# Altium schematic sheet SODIMM.SchDoc: SODIMM Harness
size A4; Engineer: Jarrett Rainier; DocumentNumber: 2; Revision: 1; SheetNumber: 1; SheetTotal: 1; ProjectTitle: Raspberry Pi Compute Module
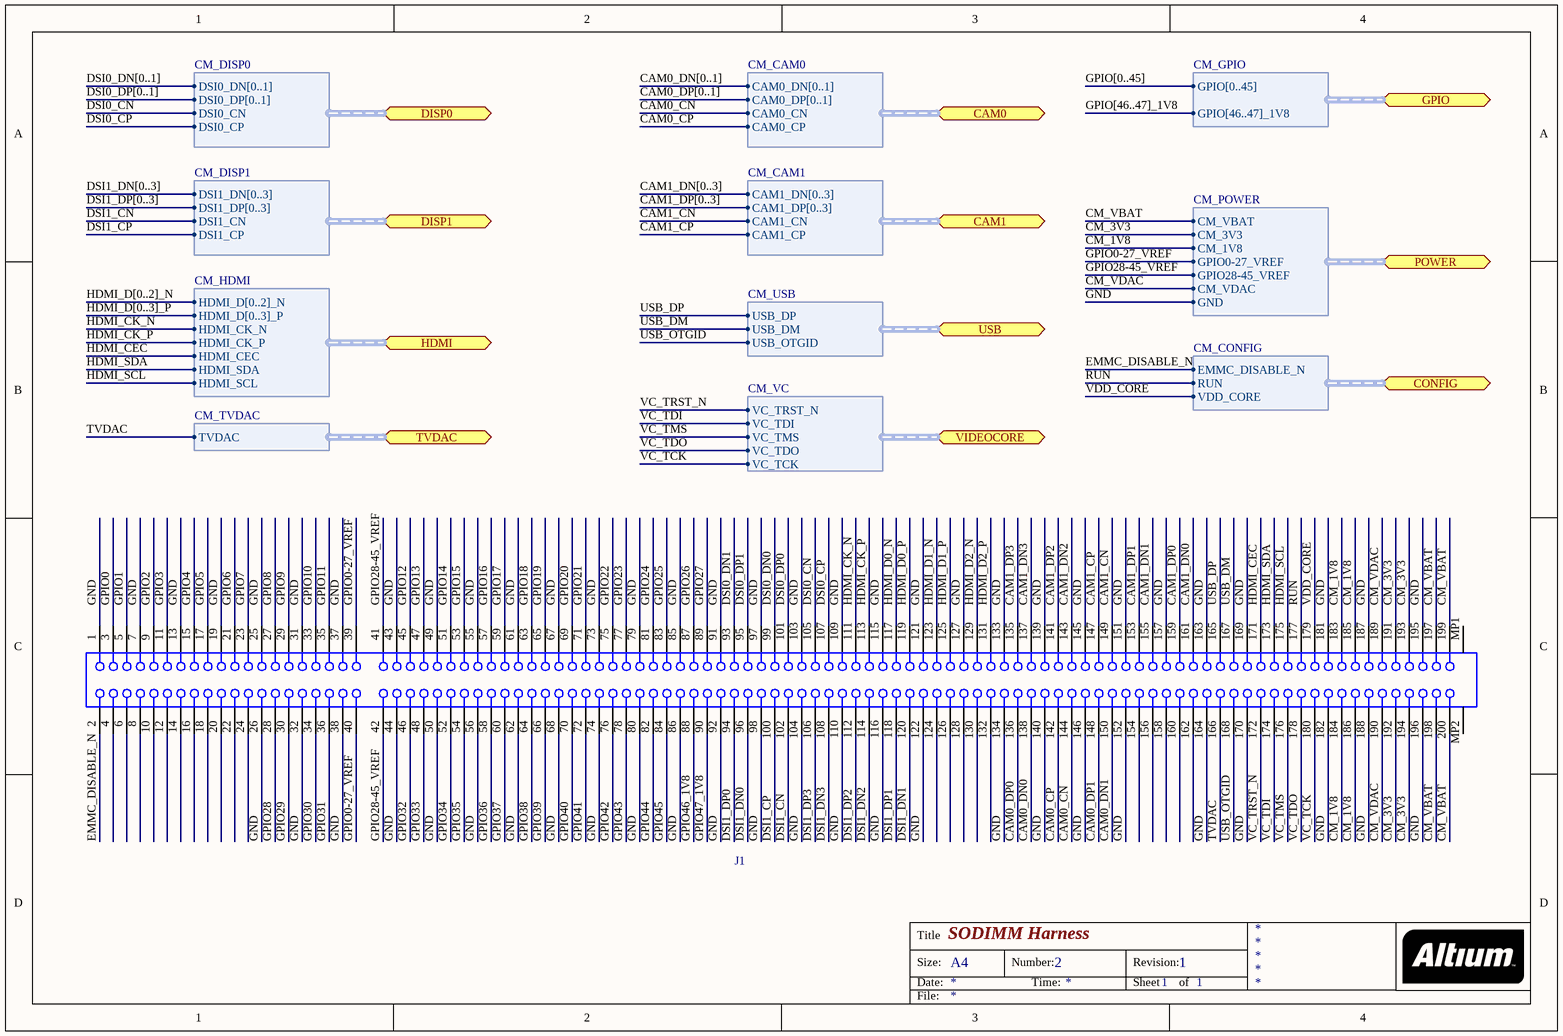
[diagram p0: SODIMM.SchDoc]

## Parts
J1  (no value)  [BTB-SM0-6-2V200]

## Ports
CAM0 (harness CM_CAM0), CAM1 (harness CM_CAM1), CONFIG (harness CM_CONFIG), DISP0 (harness CM_DISP0), DISP1 (harness CM_DISP1), GPIO (harness CM_GPIO), HDMI (harness CM_HDMI), POWER (harness CM_POWER), TVDAC (harness CM_TVDAC), USB (harness CM_USB), VIDEOCORE (harness CM_VC)

## Harnesses
CM_GPIO: GPIO[0..45], GPIO[46..47]_1V8
CM_CONFIG: EMMC_DISABLE_N, RUN, VDD_CORE
CM_CAM0: CAM0_DN[0..1], CAM0_DP[0..1], CAM0_CN, CAM0_CP
CM_POWER: CM_VBAT, CM_3V3, CM_1V8, GPIO0-27_VREF, GPIO28-45_VREF, CM_VDAC, GND
CM_CAM1: CAM1_DN[0..3], CAM1_DP[0..3], CAM1_CN, CAM1_CP
CM_DISP0: DSI0_DN[0..1], DSI0_DP[0..1], DSI0_CN, DSI0_CP
CM_DISP1: DSI1_DN[0..3], DSI1_DP[0..3], DSI1_CN, DSI1_CP
CM_HDMI: HDMI_D[0..2]_N, HDMI_D[0..3]_P, HDMI_CK_N, HDMI_CK_P, HDMI_CEC, HDMI_SDA, HDMI_SCL
CM_USB: USB_DP, USB_DM, USB_OTGID
CM_VC: VC_TRST_N, VC_TDI, VC_TMS, VC_TDO, VC_TCK
CM_TVDAC: TVDAC

## Nets
CAM0_CN: J1.144 ; port CAM0.CAM0_CN
CAM0_CP: J1.142 ; port CAM0.CAM0_CP
CAM0_DN0: J1.138
CAM0_DN1: J1.150
CAM0_DP0: J1.136
CAM0_DP1: J1.148
CAM1_CN: J1.149 ; port CAM1.CAM1_CN
CAM1_CP: J1.147 ; port CAM1.CAM1_CP
CAM1_DN0: J1.161
CAM1_DN1: J1.155
CAM1_DN2: J1.143
CAM1_DN3: J1.137
CAM1_DP0: J1.159
CAM1_DP1: J1.153
CAM1_DP2: J1.141
CAM1_DP3: J1.135
CM_1V8: J1.183 J1.184 J1.185 J1.186 ; port POWER.CM_1V8
CM_3V3: J1.191 J1.192 J1.193 J1.194 ; port POWER.CM_3V3
CM_VBAT: J1.197 J1.198 J1.199 J1.200 ; port POWER.CM_VBAT
CM_VDAC: J1.189 J1.190 ; port POWER.CM_VDAC
DSI0_CN: J1.105 ; port DISP0.DSI0_CN
DSI0_CP: J1.107 ; port DISP0.DSI0_CP
DSI0_DN0: J1.99
DSI0_DN1: J1.93
DSI0_DP0: J1.101
DSI0_DP1: J1.95
DSI1_CN: J1.102 ; port DISP1.DSI1_CN
DSI1_CP: J1.100 ; port DISP1.DSI1_CP
DSI1_DN0: J1.96
DSI1_DN1: J1.120
DSI1_DN2: J1.114
DSI1_DN3: J1.108
DSI1_DP0: J1.94
DSI1_DP1: J1.118
DSI1_DP2: J1.112
DSI1_DP3: J1.106
EMMC_DISABLE_N: J1.2 ; port CONFIG.EMMC_DISABLE_N
GND: J1.1 J1.7 J1.13 J1.19 J1.25 J1.26 J1.31 J1.32 J1.37 J1.38 J1.43 J1.44 J1.49 J1.50 J1.55 J1.56 J1.61 J1.62 J1.67 J1.68 J1.73 J1.74 J1.79 J1.80 J1.85 J1.86 J1.91 J1.92 J1.97 J1.98 J1.103 J1.104 J1.109 J1.110 J1.115 J1.116 J1.121 J1.122 J1.127 J1.133 J1.134 J1.139 J1.140 J1.145 J1.146 J1.151 J1.152 J1.157 J1.163 J1.164 J1.169 J1.170 J1.181 J1.182 J1.187 J1.188 J1.195 J1.196 ; port POWER.GND
GPIO0: J1.3
GPIO0-27_VREF: J1.39 J1.40 ; port POWER.GPIO0-27_VREF
GPIO1: J1.5
GPIO2: J1.9
GPIO3: J1.11
GPIO4: J1.15
GPIO5: J1.17
GPIO6: J1.21
GPIO7: J1.23
GPIO8: J1.27
GPIO9: J1.29
GPIO10: J1.33
GPIO11: J1.35
GPIO12: J1.45
GPIO13: J1.47
GPIO14: J1.51
GPIO15: J1.53
GPIO16: J1.57
GPIO17: J1.59
GPIO18: J1.63
GPIO19: J1.65
GPIO20: J1.69
GPIO21: J1.71
GPIO22: J1.75
GPIO23: J1.77
GPIO24: J1.81
GPIO25: J1.83
GPIO26: J1.87
GPIO27: J1.89
GPIO28: J1.28
GPIO28-45_VREF: J1.41 J1.42 ; port POWER.GPIO28-45_VREF
GPIO29: J1.30
GPIO30: J1.34
GPIO31: J1.36
GPIO32: J1.46
GPIO33: J1.48
GPIO34: J1.52
GPIO35: J1.54
GPIO36: J1.58
GPIO37: J1.60
GPIO38: J1.64
GPIO39: J1.66
GPIO40: J1.70
GPIO41: J1.72
GPIO42: J1.76
GPIO43: J1.78
GPIO44: J1.82
GPIO45: J1.84
GPIO46_1V8: J1.88
GPIO47_1V8: J1.90
HDMI_CEC: J1.171 ; port HDMI.HDMI_CEC
HDMI_CK_N: J1.111 ; port HDMI.HDMI_CK_N
HDMI_CK_P: J1.113 ; port HDMI.HDMI_CK_P
HDMI_D0_N: J1.117
HDMI_D0_P: J1.119
HDMI_D1_N: J1.123
HDMI_D1_P: J1.125
HDMI_D2_N: J1.129
HDMI_D2_P: J1.131
HDMI_SCL: J1.175 ; port HDMI.HDMI_SCL
HDMI_SDA: J1.173 ; port HDMI.HDMI_SDA
RUN: J1.177 ; port CONFIG.RUN
TVDAC: J1.166 ; port TVDAC.TVDAC
USB_DM: J1.167 ; port USB.USB_DM
USB_DP: J1.165 ; port USB.USB_DP
USB_OTGID: J1.168 ; port USB.USB_OTGID
VC_TCK: J1.180 ; port VIDEOCORE.VC_TCK
VC_TDI: J1.174 ; port VIDEOCORE.VC_TDI
VC_TDO: J1.178 ; port VIDEOCORE.VC_TDO
VC_TMS: J1.176 ; port VIDEOCORE.VC_TMS
VC_TRST_N: J1.172 ; port VIDEOCORE.VC_TRST_N
VDD_CORE: J1.179 ; port CONFIG.VDD_CORE

Not connected (* = marked no-connect by the designer): J1 4 6 8 10 12 14 16 18 20 22 24 124 126 128 130 132 154 156 158 160 162 MP1 MP2

## Buses and harness runs
bus CAM0_DN[0..1]
bus CAM0_DP[0..1]
bus CAM1_DN[0..3]
bus CAM1_DP[0..3]
bus DSI0_DN[0..1]
bus DSI0_DP[0..1]
bus DSI1_DN[0..3]
bus DSI1_DP[0..3]
bus GPIO[0..45]
bus GPIO[46..47]_1V8
bus HDMI_D[0..2]_N
bus HDMI_D[0..3]_P

## Notes on the sheet
- Title
- Size:
- Date:
- A4
- Number:
- Time:
- Revision:
- Sheet
- of
- File:

## Library data of the parts
J1 = CMP-0001-00111-1: Board-to-Board Connector, SMT, Vertical, Pitch 0.6mm, 200-Position; Mating Connector: SODIMM-CN-2P-M-R200; Component Kind: Standard; Publisher: Altium; ClassName: Board Template Connector; Package Reference: BTB-SM0-6-2V200; Datasheet Version: Jun-2003